# EAGLE design PMOD_JP_KB (EAGLE 6.6.0)
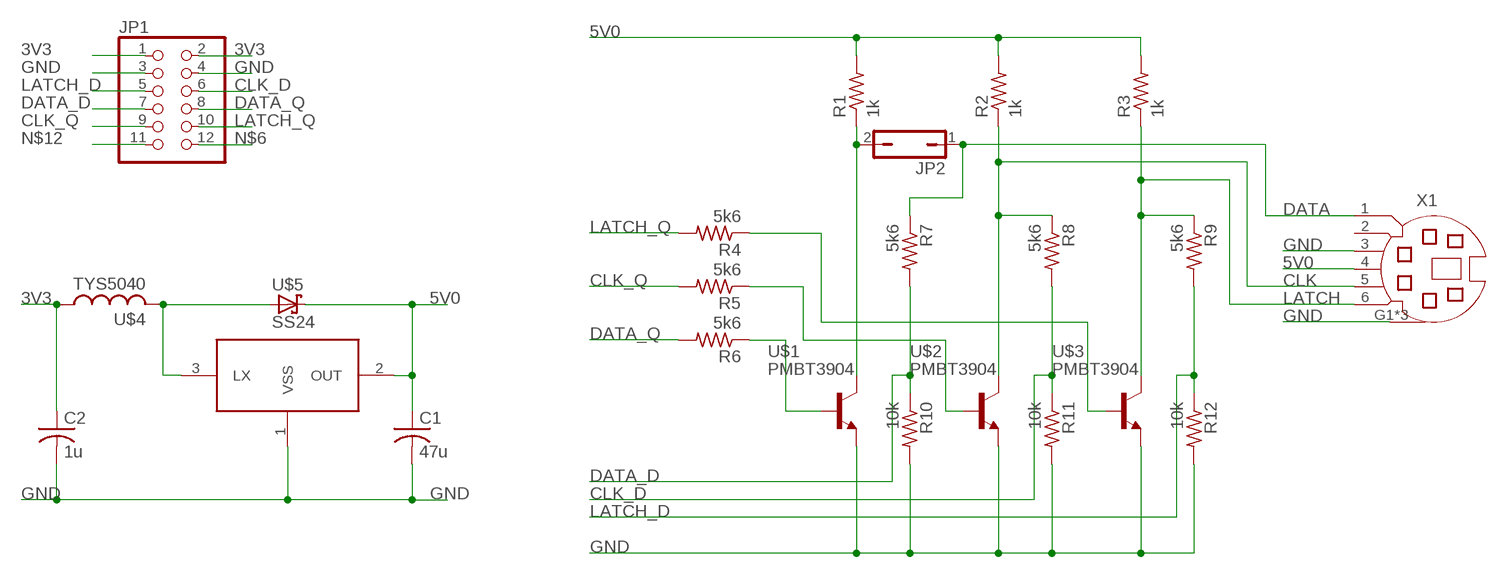
[diagram p0: schematic, sheet 1]

## Parts
C1  47u  C-USC1206K  [C1206K]
C2  1u  C-USC0805K  [C0805K]
JP1  PINHD-2X6/90  [2X06/90]
JP2  JP1Q  [JP1]
R1  1k  R-US_R0805  [R0805]
R2  1k  R-US_R0805  [R0805]
R3  1k  R-US_R0805  [R0805]
R4  5k6  R-US_R0805  [R0805]
R5  5k6  R-US_R0805  [R0805]
R6  5k6  R-US_R0805  [R0805]
R7  5k6  R-US_R0805  [R0805]
R8  5k6  R-US_R0805  [R0805]
R9  5k6  R-US_R0805  [R0805]
R10  10k  R-US_R0805  [R0805]
R11  10k  R-US_R0805  [R0805]
R12  10k  R-US_R0805  [R0805]
U$1  PMBT3904  [SOT23]
U$2  PMBT3904  [SOT23]
U$3  PMBT3904  [SOT23]
U$4  TYS5040  [TYS5040]
U$5  SS24  [SMA-DO214AC]
U$6  ME2108A  [SOT89]
X1  MD06SS  [MDIN06SS]

## Nets
3V3: C2.1 JP1.1 JP1.2 U$4.P$1
5V0: C1.1 R1.2 R2.2 R3.2 U$5.K(C) U$6.2(OUT) X1.4
CLK: R2.1 R8.1 U$2.3(C) X1.5
CLK_D: JP1.6 R8.2 R11.1
CLK_Q: JP1.9 R5.2
DATA: JP2.1 R7.1 X1.1
DATA_C: JP2.2 R1.1 U$1.3(C)
DATA_D: JP1.7 R7.2 R10.1
DATA_Q: JP1.8 R6.2
GND: C1.2 C2.2 JP1.3 JP1.4 R10.2 R11.2 R12.2 U$1.2(E) U$2.2(E) U$3.2(E) U$6.1(VSS) X1.3 X1.G1(G) X1.G2(G) X1.G3(G)
LATCH: R3.1 R9.1 U$3.3(C) X1.6
LATCH_D: JP1.5 R9.2 R12.1
LATCH_Q: JP1.10 R4.2
N$6: JP1.12
N$7: U$4.P$2 U$5.A U$6.3(LX)
N$12: JP1.11
N$16: R6.1 U$1.1(B)
N$17: R5.1 U$2.1(B)
N$18: R4.1 U$3.1(B)
Unconnected: X1.2

## Library data of the parts
C1 C2 = rcl:C-US: CAPACITOR, American symbol
JP1 = pinhead:PINHD-2X6: PIN HEADER
JP2 = jumper:JP1Q: JUMPER
R1-R12 = rcl:R-US_: RESISTOR, American symbol
U$1-U$3 = Signetics:PMBT3904
U$4 = Signetics:TYS5040
U$5 = Signetics:SS24
U$6 = Signetics:ME2108A
X1 = Signetics:MD06SS: YAMAICHI CONNECTOR; OC_FARNELL: unknown; OC_NEWARK: unknown

## Board
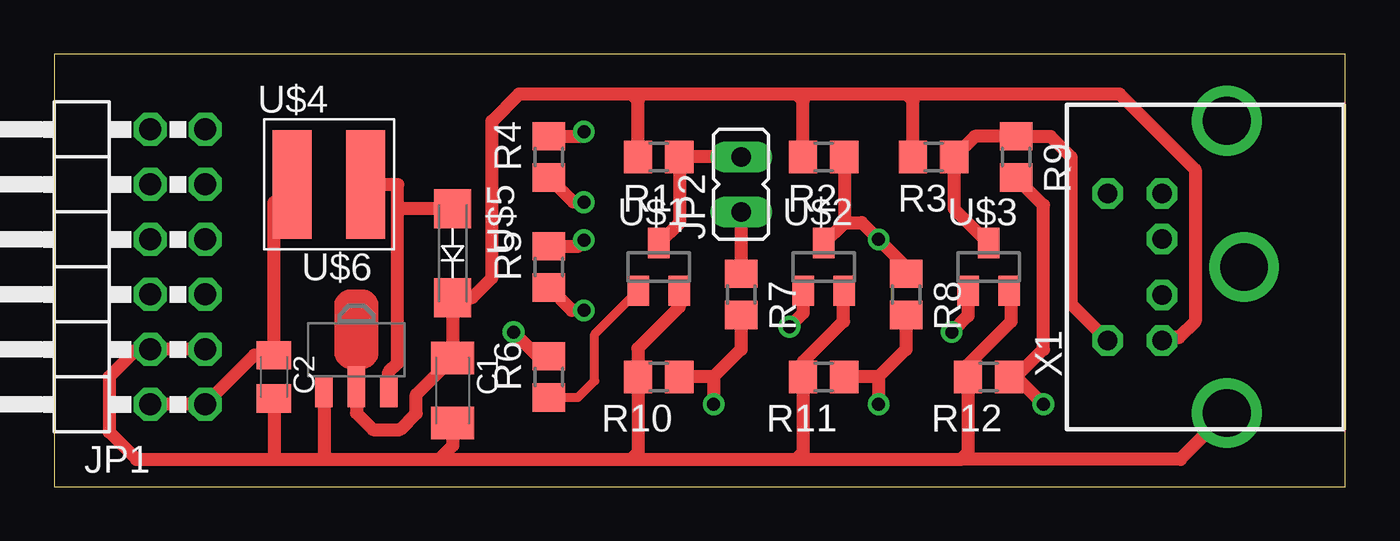
[diagram p1: board, top side]
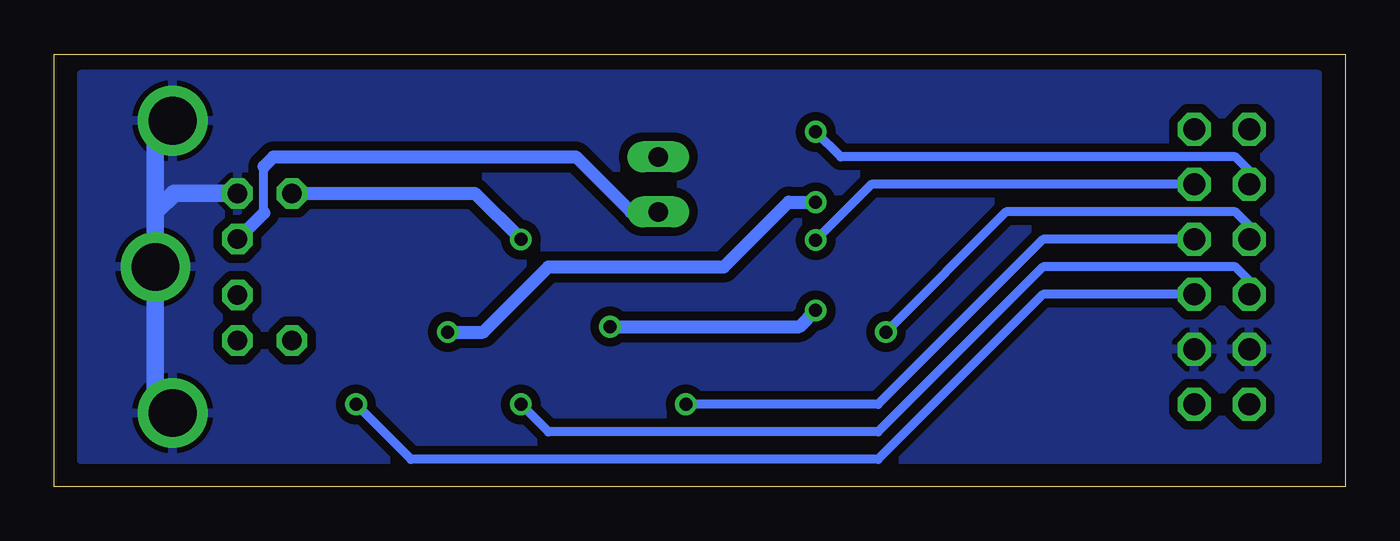
[diagram p2: board, bottom side, seen from below]

Size 59.67 x 19.99 mm. Coordinates in mm from the lower left corner, seen from the top.
Outline: 0,0 59.67,0 59.67,19.99 0,19.99 0,0
Copper layers (1*16): Top 0.035mm / dielectric 1.5mm / Bottom 0.035mm
Design rules "JLC": minimum track width 5mil, minimum drill 0.2mm, track to track 5mil, track to pad 0.2mm, pad to pad 5mil, via to via 0.54mm, smd to smd 0.003225mm, copper to edge 0.2mm, drill to drill 0.54mm, minimum pad ring 10mil, minimum via ring 8mil, stop-mask expansion 4mil, vias tented up to drill 0mil, thermal gap 10mil

### Footprints (pad centres in the part's own frame; a part is rotated, then mirrored left to right if it is on the bottom)
C1206K = smd 1.5 x 2: 1 -1.5,0; 2 1.5,0
C0805K = smd 1.3 x 1.6: 1 -1,0; 2 1,0
2X06/90 = drill 1.016 octagon: 1 -6.35,-6.35; 2 -6.35,-3.81; 3 -3.81,-6.35; 4 -3.81,-3.81; 5 -1.27,-6.35; 6 -1.27,-3.81; 7 1.27,-6.35; 8 1.27,-3.81; 9 3.81,-6.35; 10 3.81,-3.81; 11 6.35,-6.35; 12 6.35,-3.81
JP1 = drill 0.914 long: 1 0,-1.27; 2 0,1.27
R0805 = smd 1.3 x 1.5: 1 -0.95,0; 2 0.95,0
SOT23 = smd 1 x 1.4: 1 -0.95,-1.1; 2 0.95,-1.1; 3 0,1.1
TYS5040 = smd 1.8 x 5: P$1 -1.7,0; P$2 1.7,0
SMA-DO214AC = smd 1.8 x 1.7: A -2.05,0; K 2.05,0
SOT89 = smd 0.8 x 1.4: 1 -1.499,-1.981; 3 1.499,-1.981 | smd 0.8 x 1.9: 2 0,-1.727
MDIN06SS = drill 0.9 octagon: 1 1.3,8.5; 2 -1.3,8.5; 3 3.4,8.5; 4 -3.4,8.5; 5 3.4,11; 6 -3.4,11 | drill 2.2: G1 -6.75,5.5; G2 0,4.7; G3 6.75,5.5

### Placement (x,y rotation side)
C1  18.41,4.45 270 top
C2  10.16,5.08 270 top
JP1  0.64,10.16 90 top
JP2  31.75,13.97 0 top
R1  27.94,15.24 180 top
R2  35.56,15.24 180 top
R3  40.64,15.24 180 top
R4  22.86,15.24 90 top
R5  22.86,10.16 90 top
R6  22.86,5.08 90 top
R7  31.75,8.89 270 top
R8  39.37,8.89 270 top
R9  44.45,15.24 270 top
R10  27.94,5.08 180 top
R11  35.56,5.08 180 top
R12  43.18,5.08 180 top
U$1  27.94,10.16 0 top
U$2  35.56,10.16 0 top
U$3  43.18,10.16 0 top
U$4  12.7,13.97 0 top
U$5  18.41,10.79 270 top
U$6  13.97,6.35 0 top
X1  59.69,10.16 90 top

### Tracks (layer width: path | path; a pad name or v marks a point on that pad's centre or on a via)
3V3
  Top 0.61: JP1.2 JP1.1 9.26,6.08 C2.1 10.16,13.13 U$4.P$1
5V0
  Top 0.61: U$6.2 13.97,3.41 14.73,2.65 15.98,2.65 16.73,3.4 16.73,4.26 C1.1 U$5.K 19.32,8.75 20.23,9.65 20.23,16.9 21.48,18.15 26.67,18.15 | 26.67,18.15 34.29,18.15 | 34.29,18.15 39.37,18.15 | 39.37,18.15 49.23,18.15 52.73,14.65 52.73,7.65 51.98,6.9 51.33,6.9 X1.4 | R1.2 26.99,17.83 26.67,18.15 | R2.2 34.61,17.83 34.29,18.15 | R3.2 39.69,17.83 39.37,18.15
CLK  (via drill 0.6)
  Top 0.61: R2.1 36.51,12.21 | 36.51,12.21 U$2.3 | 36.51,12.21 37.32,12.21 v38.1,11.43 39.37,10.16 R8.1
  Bottom 0.61: X1.5 40.23,13.56 v38.1,11.43
CLK_D  (via drill 0.6)
  Top 0.61: R8.2 39.37,6.35 38.1,5.08 | 38.1,5.08 R11.1 | 38.1,5.08 v38.1,3.81
  Bottom 0.406: JP1.6 4.45,9.53 5.08,10.16 13.97,10.16 21.59,2.54 36.83,2.54 v38.1,3.81
CLK_Q  (via drill 0.6)
  Top 0.61: R5.2 24.19,11.11 v24.48,11.4
  Bottom 0.406: JP1.9 21.91,13.97 v24.48,11.4
DATA
  Top 0.61: JP2.1 R7.1
  Bottom 0.406: 49.98,12.65 49.98,14.79
  Bottom 0.61: X1.1 51.17,11.46 49.98,12.65 | 49.98,14.79 49.53,15.24 35.56,15.24 33.02,12.7 JP2.1
DATA_C
  Top 0.61: JP2.2 R1.1 28.89,12.21 U$1.3
DATA_D  (via drill 0.6)
  Top 0.61: R7.2 31.75,6.35 30.48,5.08 | 30.48,5.08 R10.1 | 30.48,5.08 v30.48,3.81
  Bottom 0.406: JP1.7 13.97,11.43 21.59,3.81 v30.48,3.81
DATA_Q  (via drill 0.6)
  Top 0.61: R6.2 22.35,6.03 v21.23,7.15
  Bottom 0.406: JP1.8 4.45,12.06 5.08,12.7 15.68,12.7 v21.23,7.15
GND
  Top 0.61: 10.16,1.27 3.81,1.27 2.54,2.54 2.54,5.08 3.81,6.35 JP1.4 JP1.3 | 10.16,1.27 12.7,1.27 | 12.7,1.27 17.78,1.27 | 17.78,1.27 26.67,1.27 | 26.67,1.27 34.29,1.27 | 34.29,1.27 41.91,1.27 | X1.G1 52.05,1.27 41.91,1.27 | C2.2 10.16,1.27 | U$6.1 12.47,1.5 12.7,1.27 | C1.2 18.41,1.91 17.78,1.27 | 26.67,1.27 26.99,1.59 R10.2 26.98,6.4 28.89,8.31 U$1.2 | 34.29,1.27 34.61,1.59 R11.2 34.61,5.78 36.48,7.65 36.48,9.03 U$2.2 | 41.91,1.27 42.23,1.59 R12.2 42.23,5.65 44.23,7.65 44.23,8.96 U$3.2
  Bottom 0.813: 54.99,12.7 X1.G2 54.99,4.21 X1.G1 | 54.99,12.7 54.99,16.11 X1.G3 | X1.3 54.13,13.56 54.99,12.7
  pour Bottom (isolate 0.406): 1.27,19.05 58.42,19.05 58.42,1.27 1.27,1.27
LATCH
  Top 0.61: X1.6 46.99,8.46 46.99,15.24 46.04,16.19 R9.1 42.54,16.19 R3.1 41.59,12.85 U$3.3
LATCH_D  (via drill 0.6)
  Top 0.61: 44.45,5.08 45.72,6.35 45.72,13.02 R9.2 | R12.1 44.45,5.08 | 44.45,5.08 v45.72,3.81
  Bottom 0.406: JP1.5 13.97,8.89 21.59,1.27 43.18,1.27 v45.72,3.81
LATCH_Q  (via drill 0.6)
  Top 0.61: R4.2 24.27,16.19 v24.48,16.4
  Bottom 0.406: JP1.10 4.45,14.6 5.08,15.24 23.32,15.24 v24.48,16.4
N$7
  Top 0.61: U$4.P$2 15.88,13.97 15.88,12.7 | U$6.3 15.47,5.31 15.88,5.71 15.88,12.7 | U$5.A 16.02,12.85 15.88,12.7
N$16
  Top 0.406: R6.1 24.21,4.13 24.98,4.9 24.98,7.05 U$1.1
N$17  (via drill 0.6)
  Top 0.61: U$2.1 34.61,8.03 v33.98,7.4 | v24.48,8.15 23.92,8.15 R5.1
  Bottom 0.61: v33.98,7.4 25.23,7.4 v24.48,8.15
N$18  (via drill 0.6)
  Top 0.61: U$3.1 42.23,7.9 v41.48,7.15 | v24.48,13.15 24,13.15 R4.1
  Bottom 0.61: v41.48,7.15 39.84,7.15 36.83,10.16 28.72,10.16 25.73,13.15 v24.48,13.15